# Altium schematic sheet HR911105A.SchDoc
size A4
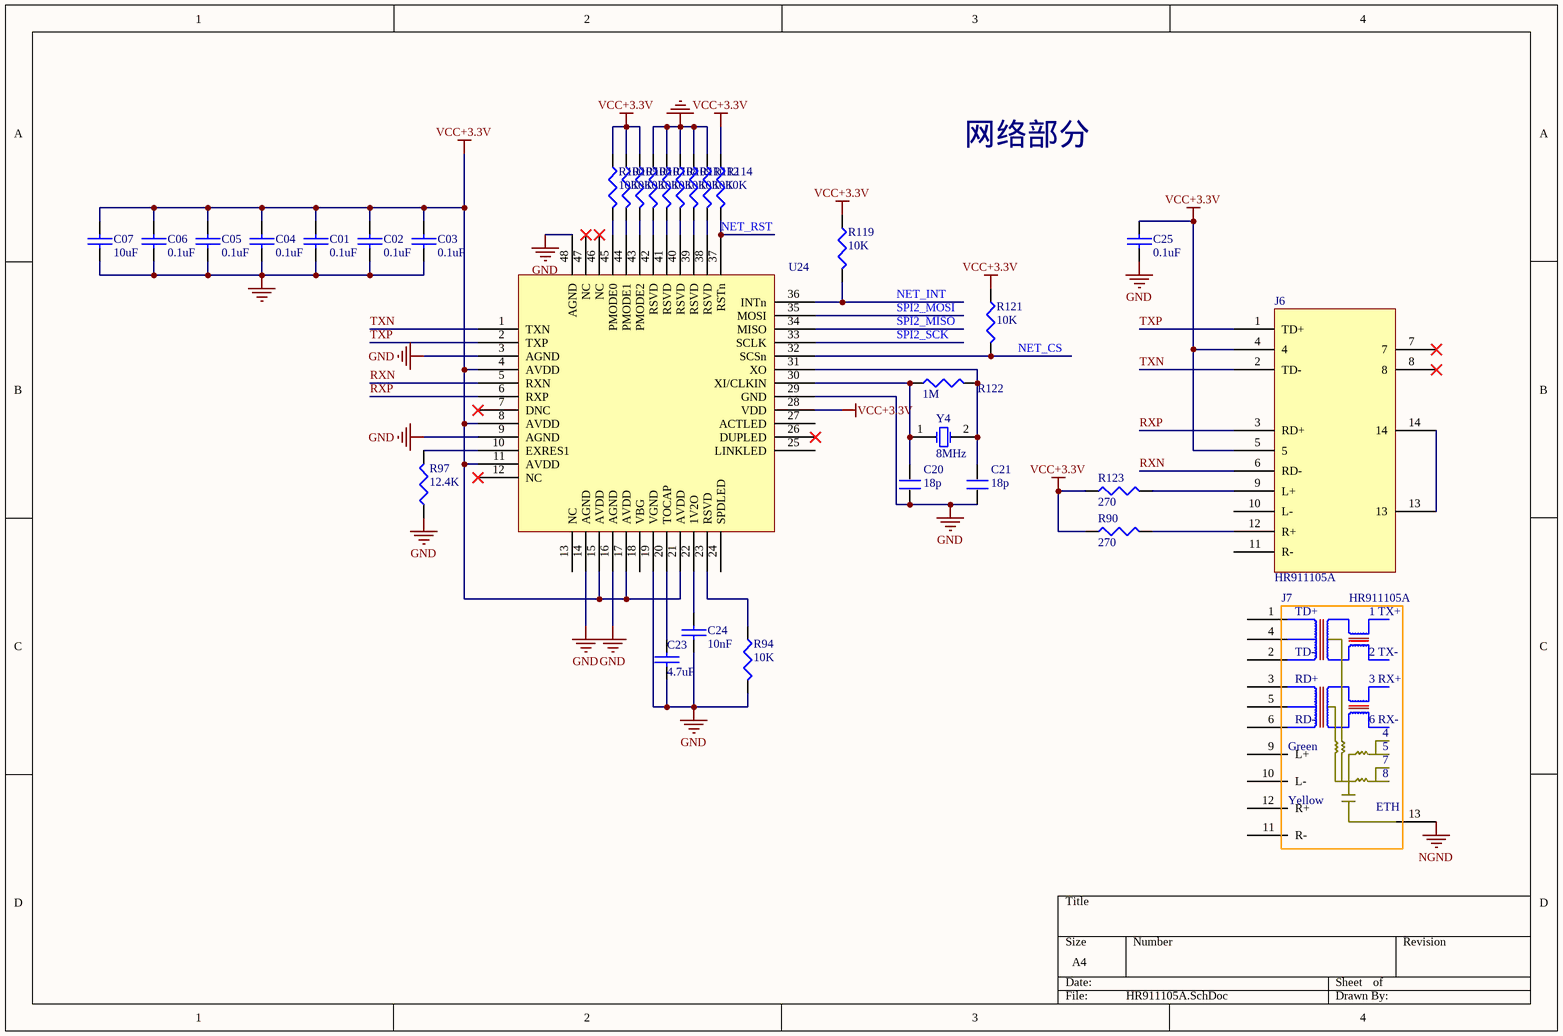
[diagram p0: HR911105A.SchDoc]

## Parts
C01  0.1uF  [0603]
C02  0.1uF  [0603]
C03  0.1uF  [0603]
C04  0.1uF  [0603]
C05  0.1uF  [0603]
C06  0.1uF  [0603]
C07  10uF  [0805]
C20  18p  [0603]
C21  18p  [0603]
C23  4.7uF  [0603]
C24  10nF  [0603]
C25  0.1uF  [0603]
J6  HR911105A  [HR911105A]
J7  HR911105A  [HR911102]
R90  270  [0603]
R94  10K  [0603]
R97  12.4K  [0603]
R100  10K  [0603]
R105  10K  [0603]
R106  10K  [0603]
R107  10K  [0603]
R108  10K  [0603]
R109  10K  [0603]
R110  10K  [0603]
R112  10K  [0603]
R114  10K  [0603]
R119  10K  [0603]
R121  10K  [0603]
R122  1M  [0603]
R123  270  [0603]
U24  W5500  [LQFP48_N]  (value not drawn)
Y4  8MHz  [XTAL_US]

## Nets
GND: C01.2 C02.2 C03.2 C04.2 C05.2 C06.2 C07.1 C20.1 C21.1 C23.1 C24.2 C25.2 R94.2 R97.1 R107.1 R108.1 R109.1 R110.1 R112.1 U24.3(AGND) U24.9(AGND) U24.14(AGND) U24.16(AGND) U24.19(VGND) U24.29(GND) U24.48(AGND)
NGND: J7.13
VCC+3.3V: C01.1 C02.1 C03.1 C04.1 C05.1 C06.1 C07.2 C25.1 J6.4 J6.5 R90.1 R100.1 R105.1 R106.1 R114.1 R119.1 R121.1 R123.1 U24.4(AVDD) U24.8(AVDD) U24.11(AVDD) U24.15(AVDD) U24.17(AVDD) U24.21(AVDD) U24.28(VDD)
NET_CS: R121.2 U24.32(SCSn)
NET_INT: R119.2 U24.36(INTn)
NET_RST: R114.2 U24.37(RSTn)
RXN: J6.6(RD-) U24.5(RXN)
RXP: J6.3(RD+) U24.6(RXP)
SPI2_MISO: U24.34(MISO)
SPI2_MOSI: U24.35(MOSI)
SPI2_SCK: U24.33(SCLK)
TXN: J6.2(TD-) U24.1(TXN)
TXP: J6.1(TD+) U24.2(TXP)
NetC20_2: C20.2 R122.1 U24.30(XI/CLKIN) Y4.1(OSC1)
NetC21_2: C21.2 R122.2 U24.31(XO) Y4.2(OSC2)
NetC23_2: C23.2 U24.20(TOCAP)
NetC24_1: C24.1 U24.22(1V2O)
NetJ6_9: J6.9(L+) R123.2
NetJ6_12: J6.12(R+) R90.2
NetJ6_13: J6.13 J6.14
NetR94_1: R94.1 U24.23(RSVD)
NetR97_2: R97.2 U24.10(EXRES1)
NetR100_2: R100.2 U24.45(PMODE0)
NetR105_2: R105.2 U24.44(PMODE1)
NetR106_2: R106.2 U24.43(PMODE2)
NetR107_2: R107.2 U24.42(RSVD)
NetR108_2: R108.2 U24.41(RSVD)
NetR109_2: R109.2 U24.40(RSVD)
NetR110_2: R110.2 U24.39(RSVD)
NetR112_2: R112.2 U24.38(RSVD)

Not connected (* = marked no-connect by the designer): J6 7* 8* 10(L-) 11(R-); J7 1 2 3 4 5 6 9(L+) 10(L-) 11(R-) 12(R+); U24 7(DNC)* 12(NC)* 13(NC) 18(VBG) 24(SPDLED) 25(LINKLED) 26(DUPLED)* 27(ACTLED) 46(NC)* 47(NC)*

## Notes on the sheet
- 网络部分
- (in symbol HR911102) TD+; 1 TX+; TD-; 2 TX-; RD+; 3 RX+; RD-; 6 RX-; Green; 7; 8; Yellow; ETH

## Library data of the parts
C01 C02 C03 C04 C05 C06 C24 C25 = CAP
C07 C23 = CAP: 0.1uF
C20 C21 = C
J7 = HR911102
R90 R94 R97 R100 R105-R110 R112 R114 R119 R121-R123 = RES1
U24 = W5500: 以太网
Y4 = XTAL: Crystal Oscillator; Published: 8-Jun-2000; LatestRevisionDate: 17-Jul-2002; LatestRevisionNote: Re-released for DXP Platform.; Publisher: Altium Limited